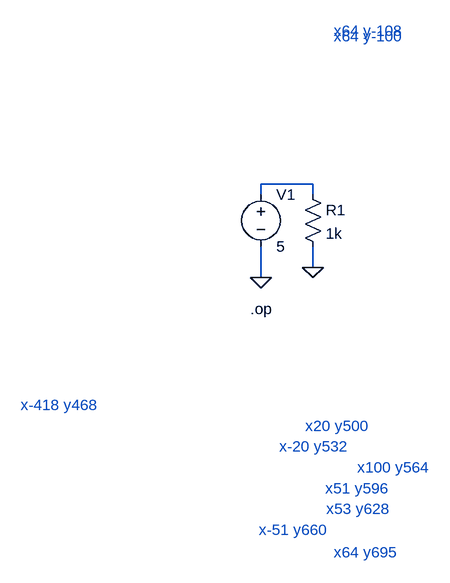
[diagram p0: schematic text_off_grid.asc]
text_off_grid.asc, the LTspice schematic file:
Version 4.1
SHEET 1 1433 977
WIRE 32 128 -48 128
WIRE -48 144 -48 128
WIRE 32 144 32 128
WIRE 32 256 32 224
WIRE -48 272 -48 224
FLAG 32 256 0
FLAG -48 272 0
SYMBOL voltage -48 128 R0
SYMATTR InstName V1
SYMATTR Value 5
SYMBOL res 16 128 R0
SYMATTR InstName R1
SYMATTR Value 1k
TEXT -418 468 Left 2 ;x-418 y468
TEXT 20 500 Left 2 ;x20 y500
TEXT -20 532 Left 2 ;x-20 y532
TEXT 100 564 Left 2 ;x100 y564
TEXT 51 596 Left 2 ;x51 y596
TEXT 53 628 Left 2 ;x53 y628
TEXT -51 660 Left 2 ;x-51 y660
TEXT 64 695 Left 2 ;x64 y695
TEXT 64 -100 Left 2 ;x64 y-100
TEXT 64 -108 Left 2 ;x64 y-108
TEXT -64 320 Left 2 !.op

The netlist it stands for:
* text_off_grid.asc
V1 N001 0 5
R1 N001 0 1k
* x-418 y468
* x20 y500
* x-20 y532
* x100 y564
* x51 y596
* x53 y628
* x-51 y660
* x64 y695
* x64 y-100
* x64 y-108
.op
.backanno
.end